# EAGLE design design1 (EAGLE 7.3.0)
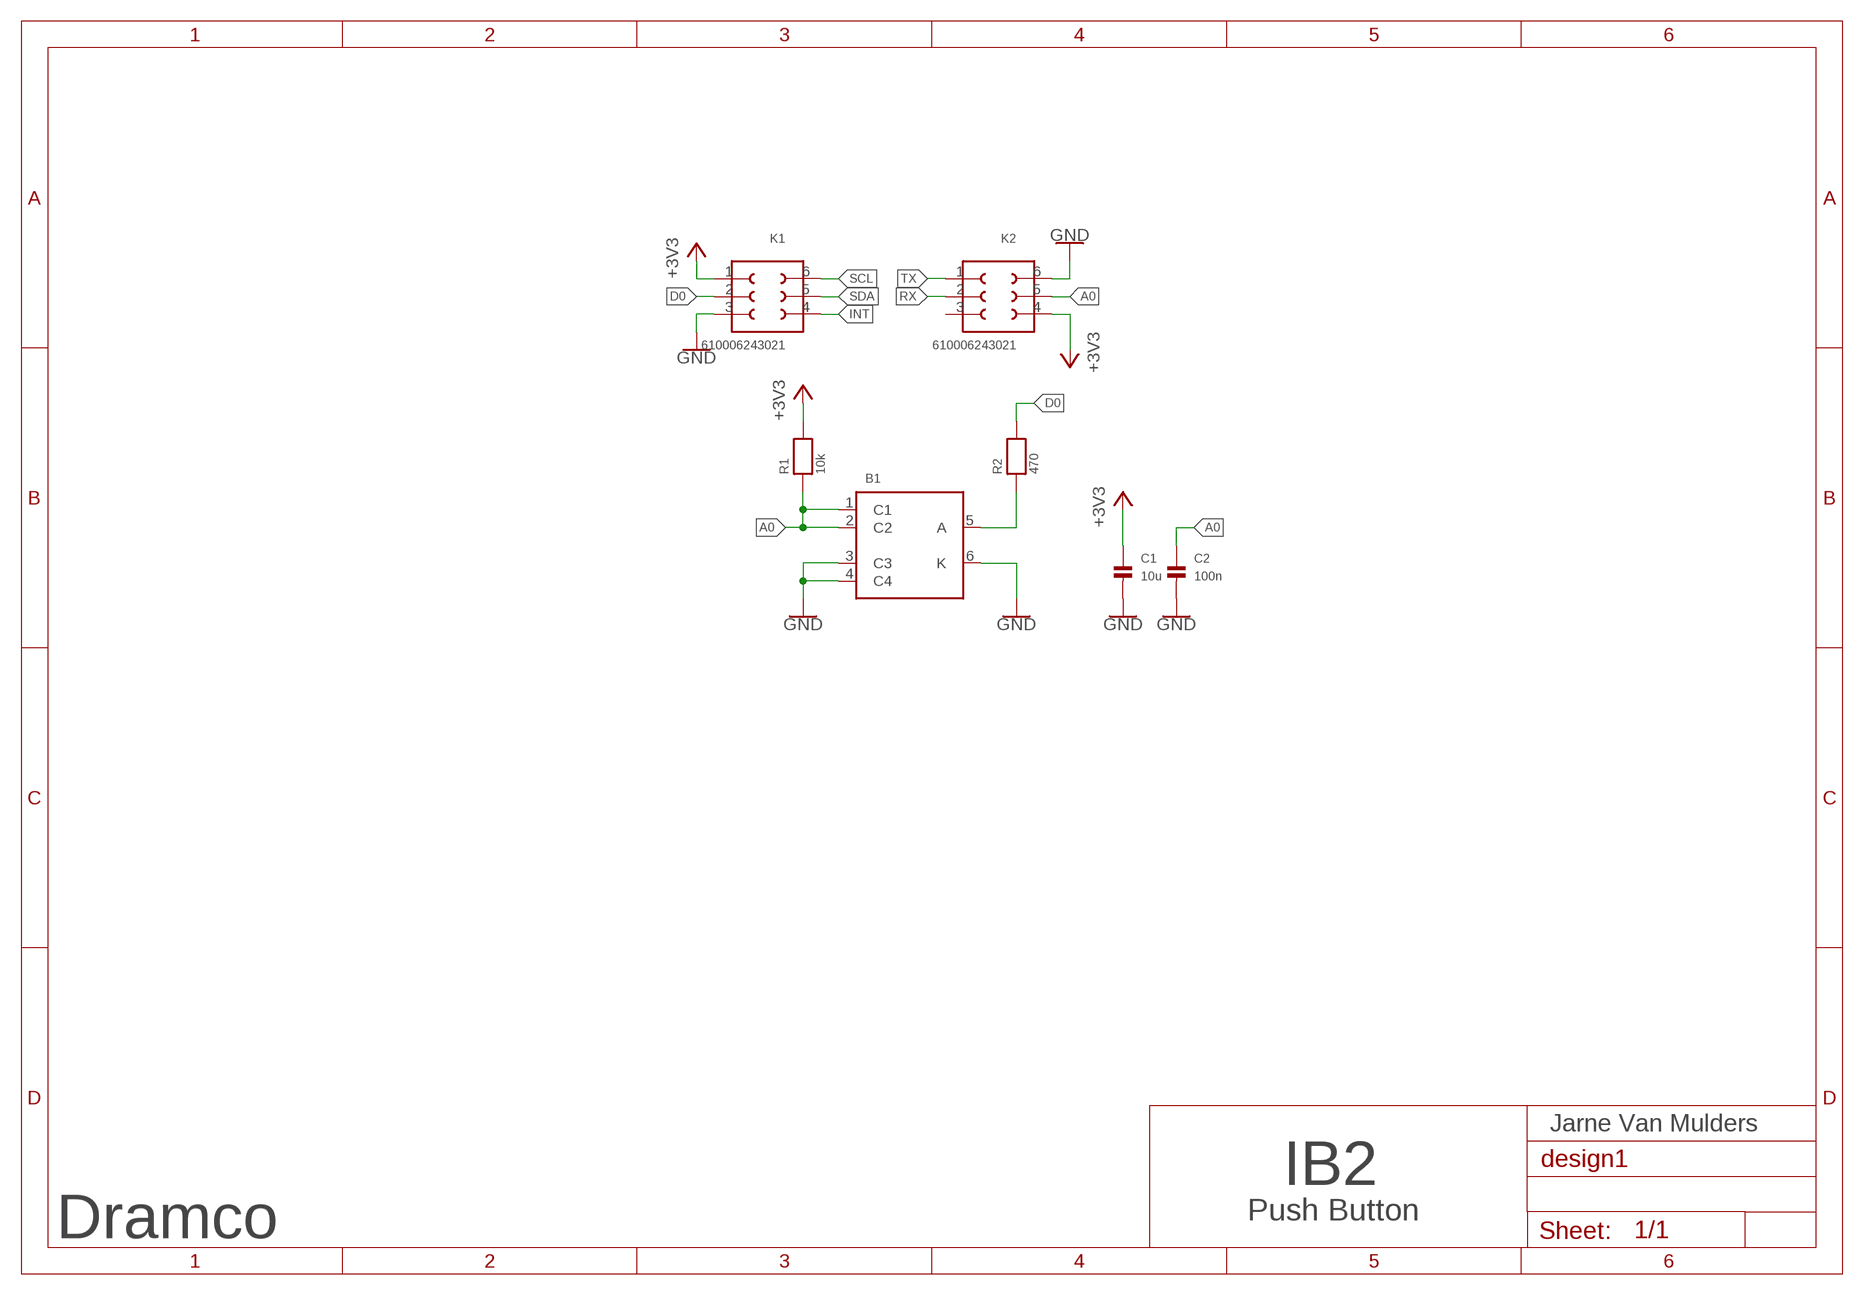
[diagram p0: schematic, sheet 1]

## Parts
B1  TS121273_AKSMD  [TS121273_AKSMD]
C1  10u  CAP_CERAMIC0805  [0805]
C2  100n  CAP_CERAMIC0603  [0603]
K1  610006243021  [610006243021]
K2  610006243021  [610006243021]
R1  10k  RESISTOR0603  [0603]
R2  470  RESISTOR0603  [0603]

## Nets
+3V3: C1.1 K1.1 K2.4 R1.2
A0: B1.1(C1) B1.2(C2) C2.1 K2.5 R1.1
D0: K1.2 R2.2
GND: B1.3(C3) B1.4(C4) B1.6(K) C1.2 C2.2 K1.3 K2.6
INT: K1.4
N$3: B1.5(A) R2.1
RX: K2.2
SCL: K1.6
SDA: K1.5
TX: K2.1
Unconnected: K2.3

## Notes on the sheet
- Jarne Van Mulders
- IB2
- Push Button
- Dramco

## Library data of the parts
B1 = TS121273:TS121273_AKSMD
C1 C2 = microbuilder:CAP_CERAMIC: Ceramic Capacitors 0402 - 0402 Surface Mount Capacitors 16pF 50V 5% [Digikey: 445-4899-2-ND] 18pF 50V 5% [Digikey: 490-1281-2-ND] 22pF 50V 5% [Digikey: 490-1283-2-ND] 68pF 50V 5% [Digikey: 490-1289-2-ND] 0.1uF 10V 10% [Digikey: 490-1318-2-ND] 1.0uF 6.3V 10% [Digikey: 490-1320-2-ND] 0603 - 0603 Surface Mount Capacitors 16 pF 50V 5% [Digikey: 445-5051-2-ND] 22 pF 50V [Digikey: PCC220ACVTR-ND] 33 pF 50V 5% [Digikey: 490-1415-1-ND] 56pF 50V 5% [Digikey: 490-1421-1-ND] 220pF 50V 5% [Digikey: 445-1285-1-ND] 680 pF 50V 2200 pF 50V 5% C0G [Digikey: 445-1297-1-ND] 5600 pF 100V 5% X7R [Digikey: 478-3711-1-ND] 0.1 µF 25V 10% [Digikey: PCC2277TR-ND] 0.22 µF 16V 10% X7R [Digikey: 445-1318-1-ND] 1.0 µF 25V 10% [Digikey: 445-5146-2-ND] 0603 - RF Specific 3pF 250V +/-0.1pF RF [Digikey: 712-1347-1-ND] 18 pF 250V 5% [Digikey: 478-3505-1-ND or 712-1322-1-ND] 56 pF 250V 5% C0G RF [Digikey: 490-4867-1-ND] 68 pF 250V RF [Digikey: 490-4868-1-ND] 0805 - 0805 Surface Mount Capacitors 220 pF 250V 2% RF Ceramic Capacitor [Digikey: 712-1398-1-ND] 1000 pF 50V 2% NP0 Ceramic Capacitor [Digikey: 478-3760-1-ND] 0.1 µF 25V 10% Ceramic Capacitor [Digikey: PCC1828TR-ND] 1.0 µF 16V 10% Ceramic Capacitor[Digikey: 490-1691-2-ND] 10.0 µF 10V 10% Ceramic Capacitor[Digikey: 709-1228-1-ND] 10.0 uF 16V 10% Ceramic Capacitor [Digikey: 478-5165-2-ND] 47 uF 6.3V 20% Ceramic Capacitor [Digikey: 587-1779-1-ND or 399-5506-1-ND] 1206 - 1206 Surface Mount Capacitors 47uF 10V 20% Ceramic Capacitor [Digikey: 490-5528-1-ND or 399-5508-1-ND or 445-6010-1-ND] 100uF 6.3V -20%, +80% Y5V Ceramic Capacitor (Digikey: 490-4512-1-ND, Mouser: 81-GRM31CF50J107ZE1L)
K1 K2 = Wurth_Elektronik_Electromechanic_Board_to_Board_Connectors_rev15c:610006243021: WR-PHD 2.54mm SMT Dual Socket Header Bottom Entry, 6 Pins=>Code : Con_BTB_SHD_2.54_2_610006243021 <http://katalog.we-online.de/media/images/eican/Con_BTB_SHD_2.54_2_6100xx243021_pf2.jpg> Details see: http://katalog.we-online.de/en/em/610_0xx_243_021 Created 2014-05-30, Karrer Zheng 2014 (C) Würth Elektronik
R1 R2 = microbuilder:RESISTOR: Resistors 0402 - 0402 Surface Mount Package 22 Ohm 1% 1/16W [Digikey: 311-22.0LRTR-ND] 33 Ohm 5% 1/16W 1.0K 5% 1/16W 1.5K 5% 1/16W 2.0K 1% 1/16W 10.0K 1% 1/16W [Digikey: 311-10.0KLRTR-ND] 10.0K 5% 1/16W [Digikey: RMCF0402JT10K0TR-ND] 12.1K 1% 1/16W [Digikey: 311-22.0LRTR-ND] 100.0K 5% 1/16W 0603 - 0603 Surface Mount Package 0 Ohm 1/10 Watt 1% Resistor 15 Ohm 1/10 Watt 1% Resistor 33 Ohm 1/10 Watt 1% Resistor 49.9 Ohm 1/10 Watt 1% Resistor 100 Ohm 1/10 Watt 1% Resistor 150 Ohm 1/10 Watt 1% Resistor 240 Ohm 1/10 Watt 1% Resistor 390 Ohm 1/10 Watt 1% Resistor 560 Ohm 1/10 Watt 1% Resistor 680 Ohm 1/10 Watt 1% Resistor 750 Ohm 1/10 Watt 1% Resistor 1.0K Ohm 1/10 Watt 1% Resistor 1.5K Ohm 1/10 Watt 1% Resistor 2.0K Ohm 1/10 Watt 1% Resistor 2.2K Ohm 1/10 Watt 1% Resistor 3.3K Ohm 1/10 Watt 1% Resistor 4.7K Ohm 1/10 Watt 1% Resistor 10.0K Ohm 1/10 Watt 1% Resistor 12.0K Ohm 1/10 Watt 1% Resistor 12.1K Ohm 1/10 Watt 1% Resistor 20.0K Ohm 1/10 Watt 1% Resistor 33.0K Ohm 1/10 Watt 1% Resistor 100.0K Ohm 1/10 Watt 1% Resistor 0805 - 0805 Surface Mount Package 0 Ohm 1/8 Watt 1% Resistor 33 Ohm 1/8 Watt 1% Resistor 100 Ohm 1/8 Watt 1% Resistor 150 Ohm 1/8 Watt 1% Resistor 200 Ohm 1/8 Watt 1% Resistor 240 Ohm 1/8 Watt 1% Resistor 330 Ohm 1/8 Watt 1% Resistor 390 Ohm 1/8 Watt 1% Resistor 470 Ohm 1/8 Watt 1% Resistor 1.0K Ohm 1/8 Watt 1% Resistor 1.5K Ohm 1/8 Watt 1% Resistor 2.0K Ohm 1/8 Watt 1% Resistor 4.7K Ohm 1/8 Watt 1% Resistor 5.1K Ohm 1/8 Watt 1% Resistor 5.6K Ohm 1/8 Watt 1% Resistor 10.0K Ohm 1/8 Watt 1% Resistor 22.0K Ohm 1/8 Watt 1% Resistor 33.0K Ohm 1/8 Watt 1% Resistor 100K Ohm 1/8 Watt 1% Resistor 1206 - 1206 Surface Mount Package 2012 - 2010 Surface Mount Package 0.11 Ohm 1/2 Watt 1% Resistor - Digikey: RHM.11UCT-ND

## Board
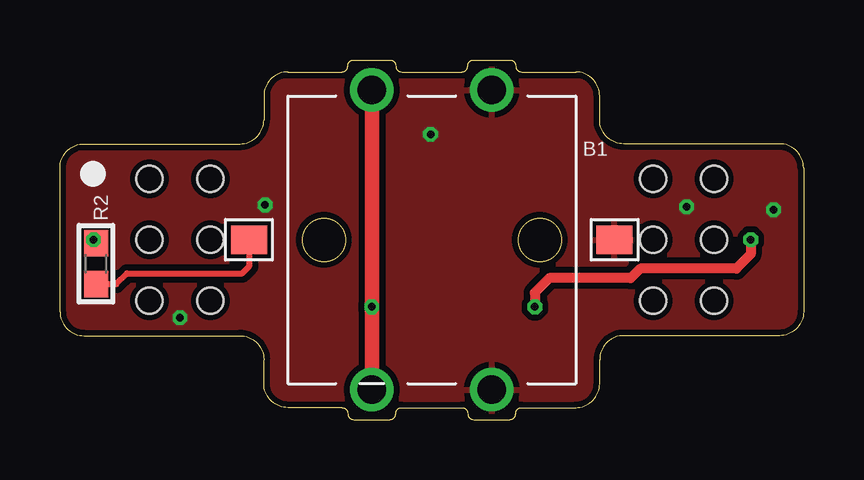
[diagram p1: board, top side]
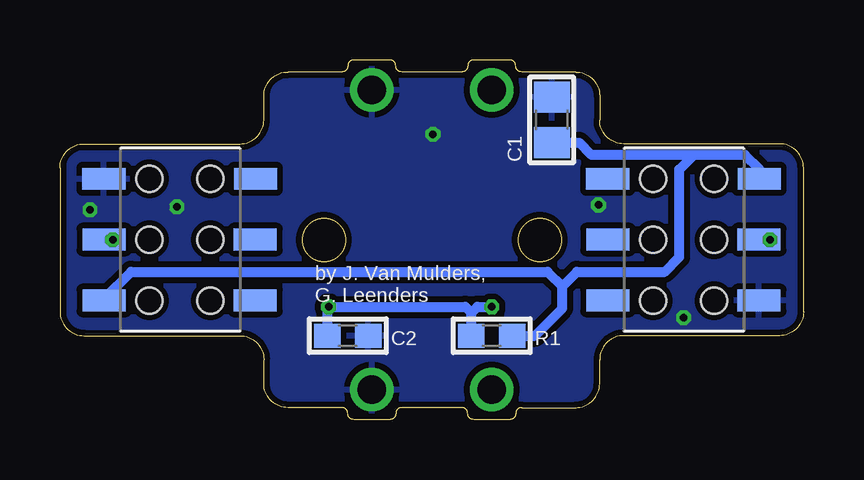
[diagram p2: board, bottom side, seen from below]

Size 31 x 15 mm. Coordinates in mm from the lower left corner, seen from the top.
Outline: 0,4.5 0,10.5 arc-90 1,11.5 7.5,11.5 arc90 8.5,12.5 8.5,13.5 arc-90 9.5,14.5 11.75,14.5 arc90 12,14.75 arc-90 12.25,15 13.75,15 arc-90 14,14.75 arc90 14.25,14.5 16.75,14.5 arc90 17,14.75 arc-90 17.25,15 18.75,15 arc-90 19,14.75 arc90 19.25,14.5 21.5,14.5 arc-90 22.5,13.5 22.5,12.5 arc90 23.5,11.5 30,11.5 arc-90 31,10.5 31,4.5 arc-90 30,3.5 23.5,3.5 arc90 22.5,2.5 22.5,1.5 arc-90 21.5,0.5 19.25,0.5 arc90 19,0.25 arc-90 18.75,0 17.25,0 arc-90 17,0.25 arc90 16.75,0.5 14.25,0.5 arc90 14,0.25 arc-90 13.75,0 12.25,0 arc-90 12,0.25 arc90 11.75,0.5 9.5,0.5 arc-90 8.5,1.5 8.5,2.5 arc90 7.5,3.5 1,3.5 arc-90 0,4.5
Copper layers (1*16): Top 0.035mm / dielectric 1.5mm / Bottom 0.035mm
Design rules "SeeedStudio_2layer_DRU_no_angle_20140221": minimum track width 6mil, minimum drill 12mil, track to track 6mil, track to pad 6mil, pad to pad 6mil, via to via 6mil, smd to smd 0mil, copper to edge 10mil, drill to drill 10mil, minimum pad ring 10mil, minimum via ring 6mil, stop-mask expansion 2mil, vias tented up to drill 100mil, thermal gap 10mil

### Footprints (pad centres in the part's own frame; a part is rotated, then mirrored left to right if it is on the bottom)
TS121273_AKSMD = drill 1.2: 1 -6.25,2.5; 2 6.25,2.5; 3 -6.25,-2.5; 4 6.25,-2.5 | smd 1.2 x 1.5: 5 0,7.62; 6 0,-7.62
0805 = smd 1.3 x 1.5: 1 -0.95,0; 2 0.95,0
0603 = smd 1.1 x 1: 1 -0.85,0; 2 0.85,0
610006243021 = smd 0.9 x 1.8: 1 -2.54,3.15; 2 -0.01,3.14; 3 2.53,3.14; 4 2.53,-3.16; 5 -0.01,-3.16; 6 -2.54,-3.17 | hole 1.1: -2.54,1.27; 0,1.27; 0,-1.27; -2.54,-1.27; 2.54,1.27; 2.54,-1.27

### Placement (x,y rotation side)
B1  15.5,7.5 90 top
C1  10.5,12.5 90 bottom
C2  19,3.5 0 bottom
K1  5,7.5 270 bottom
K2  26,7.5 270 bottom
R1  13,3.5 0 bottom
R2  1.5,6.5 90 top

### Tracks (layer width: path | path; a pad name or v marks a point on that pad's centre or on a via)
+3V3
  Bottom 0.406: K1.1 1.85,10.45 2.44,11.04 4.57,11.04 | 4.57,11.04 8.84,11.04 9.35,11.55 C1.1 | R1.2 11.2,3.5 10.06,4.64 10.06,5.55 | 10.06,5.55 9.45,6.16 5.79,6.16 5.18,6.77 5.18,10.43 4.57,11.04 | K2.4 29.16,5.04 28.04,6.16 10.67,6.16 10.06,5.55
A0  (via drill 0.31)
  Top 0.406: v28.8,7.5 28.8,6.9 28.2,6.3 24.2,6.3 23.8,5.9 20.4,5.9 19.8,5.3 v19.8,4.7
  Top 0.61: B1.2 v13,4.7 B1.1
  Bottom 0.406: K2.5 v28.81,7.51 v28.8,7.5 | C2.1 19.85,4.65 v19.8,4.7 14.1,4.7 13.85,4.45 | R1.1 13.85,4.45 | 13.85,4.45 13.6,4.7 v13,4.7
D0  (via drill 0.31)
  Top 0.254: v1.4,7.5 1.35,7.5 R2.2
  Bottom 0.254: K1.2 v1.41,7.51 v1.4,7.5
GND  (via drill 0.31)
  other vias: 15.45,11.9 5,4.25 29.75,8.75 26.12,8.88 8.55,8.95
  pour Bottom (isolate 0.254): -3.5,17.5 34.25,17.5 34.25,-3.25 -3.5,-3.25
  pour Top (isolate 0.254): -3.75,19.25 36.75,19.25 36.75,-4.25 -3.25,-4.25 arc-90 -3.75,-3.75
N$3
  Top 0.254: R2.1 2.35,5.65 2.8,6.1 7.6,6.1 7.88,6.38 B1.5

### Text on the board
bPlace: by J. Van Mulders, / G. Leenders
bStop: CONTROLLER